# EAGLE schematic Ex 7 Segment Display Common Cathode (EAGLE 7.6.0)
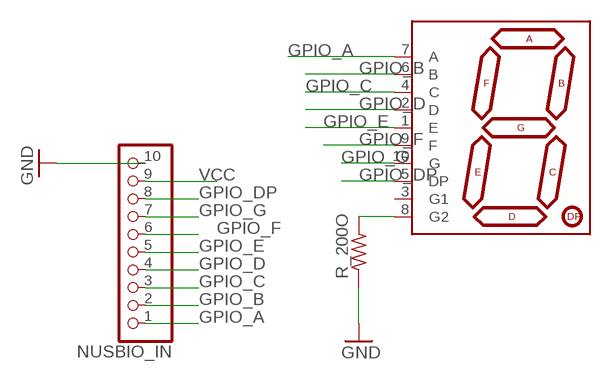
[diagram p0: schematic, sheet 1]

## Parts
NUSBIO_IN  PINHD-1X10  [1X10-BIG]
R_200O  R-US_R1206  [R1206]
U$1  7-SEGMENT-DISPLAYPTH  [7-SEGMENT-DISPLAY]

## Nets
GND: NUSBIO_IN.10 R_200O.1
GPIO_A: NUSBIO_IN.1 U$1.7(A)
GPIO_B: NUSBIO_IN.2 U$1.6(B)
GPIO_C: NUSBIO_IN.3 U$1.4(C)
GPIO_D: NUSBIO_IN.4 U$1.2(D)
GPIO_DP: NUSBIO_IN.8 U$1.5(DP)
GPIO_E: NUSBIO_IN.5 U$1.1(E)
GPIO_F: NUSBIO_IN.6 U$1.9(F)
GPIO_G: NUSBIO_IN.7 U$1.10(G)
N$1: R_200O.2 U$1.8(G2)
VCC: NUSBIO_IN.9
Unconnected: U$1.3(G1)

## Library data of the parts
NUSBIO_IN = adafruit:PINHD-1X10: Pin header 1x10 0.1" spacing With round pins
R_200O = adafruit:R-US_: RESISTOR, American symbol
U$1 = SparkFun-Displays:7-SEGMENT-DISPLAY